# EAGLE design Ffrydiau_controls (EAGLE 9.6.2)
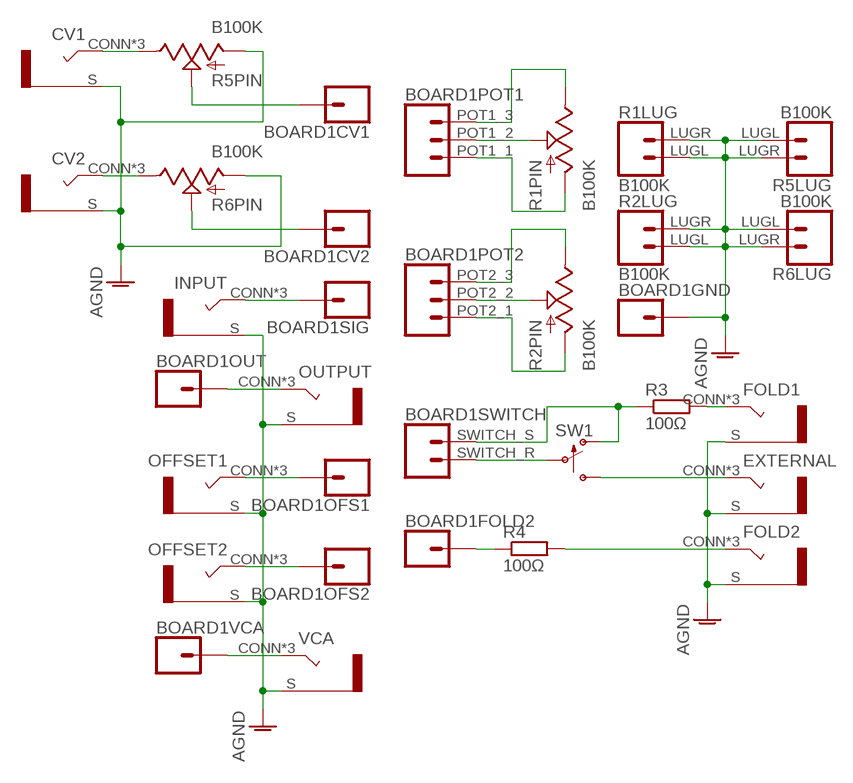
[diagram p0: schematic, sheet 1]

## Parts
BOARD1  FFRYDIAU_LINK  [FFRYDIAU]
CV1  COMBI-JACKCINCHNANA  [NEWCOMBOJACK_PANEL]
CV2  COMBI-JACKCINCHNANA  [NEWCOMBOJACK_PANEL]
EXTERNAL  COMBI-JACKCINCHNANA  [NEWCOMBOJACK_PANEL]
FOLD1  COMBI-JACKCINCHNANA  [NEWCOMBOJACK_PANEL]
FOLD2  COMBI-JACKCINCHNANA  [NEWCOMBOJACK_PANEL]
INPUT  COMBI-JACKCINCHNANA  [NEWCOMBOJACK_PANEL]
OFFSET1  COMBI-JACKCINCHNANA  [NEWCOMBOJACK_PANEL]
OFFSET2  COMBI-JACKCINCHNANA  [NEWCOMBOJACK_PANEL]
OUTPUT  COMBI-JACKCINCHNANA  [NEWCOMBOJACK_PANEL]
R1  B100K  POTENTIOMETER  [ALPHA_RV09_9MMPOT]
R2  B100K  POTENTIOMETER  [ALPHA_RV09_9MMPOT]
R3  100Ω  R-EU_0207/10  [0207/10]
R4  100Ω  R-EU_0207/10  [0207/10]
R5  B100K  POTENTIOMETER  [ALPHA_RV09_9MMPOT]
R6  B100K  POTENTIOMETER  [ALPHA_RV09_9MMPOT]
SW1  SPDT_SWITCHDW1  [MICRODPDT-DW1]
VCA  COMBI-JACKCINCHNANA  [NEWCOMBOJACK_PANEL]

## Nets
AGND: BOARD1.GND CV1.S CV2.S EXTERNAL.S FOLD1.S FOLD2.S INPUT.S OFFSET1.S OFFSET2.S OUTPUT.S R1.LUGL R1.LUGR R2.LUGL R2.LUGR R5.C1(PIN:A) R5.LUGL R5.LUGR R6.C1(PIN:A) R6.LUGL R6.LUGR VCA.S
N$1: CV1.CONN(T) CV1.T1(T) CV1.T2(T) R5.C3(PIN:B)
N$2: BOARD1.CV1 R5.C2(PIN:W)
N$3: BOARD1.SIG INPUT.CONN(T) INPUT.T1(T) INPUT.T2(T)
N$4: BOARD1.OUT OUTPUT.CONN(T) OUTPUT.T1(T) OUTPUT.T2(T)
N$5: BOARD1.POT1_2 R1.C2(PIN:W)
N$6: BOARD1.OFS1 OFFSET1.CONN(T) OFFSET1.T1(T) OFFSET1.T2(T)
N$7: BOARD1.OFS2 OFFSET2.CONN(T) OFFSET2.T1(T) OFFSET2.T2(T)
N$8: BOARD1.VCA VCA.CONN(T) VCA.T1(T) VCA.T2(T)
N$9: BOARD1.POT1_1 R1.C1(PIN:A)
N$10: BOARD1.POT1_3 R1.C3(PIN:B)
N$11: BOARD1.POT2_2 R2.C2(PIN:W)
N$12: BOARD1.POT2_3 R2.C3(PIN:B)
N$13: BOARD1.POT2_1 R2.C1(PIN:A)
N$14: BOARD1.SWITCH_S R3.1 SW1.C1(O)
N$15: FOLD1.CONN(T) FOLD1.T1(T) FOLD1.T2(T) R3.2
N$16: BOARD1.SWITCH_R SW1.C2(P)
N$17: EXTERNAL.CONN(T) EXTERNAL.T1(T) EXTERNAL.T2(T) SW1.C3(S)
N$19: BOARD1.FOLD2 R4.1
N$20: FOLD2.CONN(T) FOLD2.T1(T) FOLD2.T2(T) R4.2
N$21: CV2.CONN(T) CV2.T1(T) CV2.T2(T) R6.C3(PIN:B)
N$22: BOARD1.CV2 R6.C2(PIN:W)

## Library data of the parts
BOARD1 = ElectricNoodleBox:FFRYDIAU_LINK
CV1 CV2 EXTERNAL FOLD1 FOLD2 INPUT OFFSET1 OFFSET2 OUTPUT VCA = ElectricNoodleBox:COMBI-JACK
R1 R2 R5 R6 = ElectricNoodleBox:POTENTIOMETER
R3 R4 = rcl:R-EU_: RESISTOR, European symbol; SPICEPREFIX: R
SW1 = ElectricNoodleBox:SPDT_SWITCH

## Board
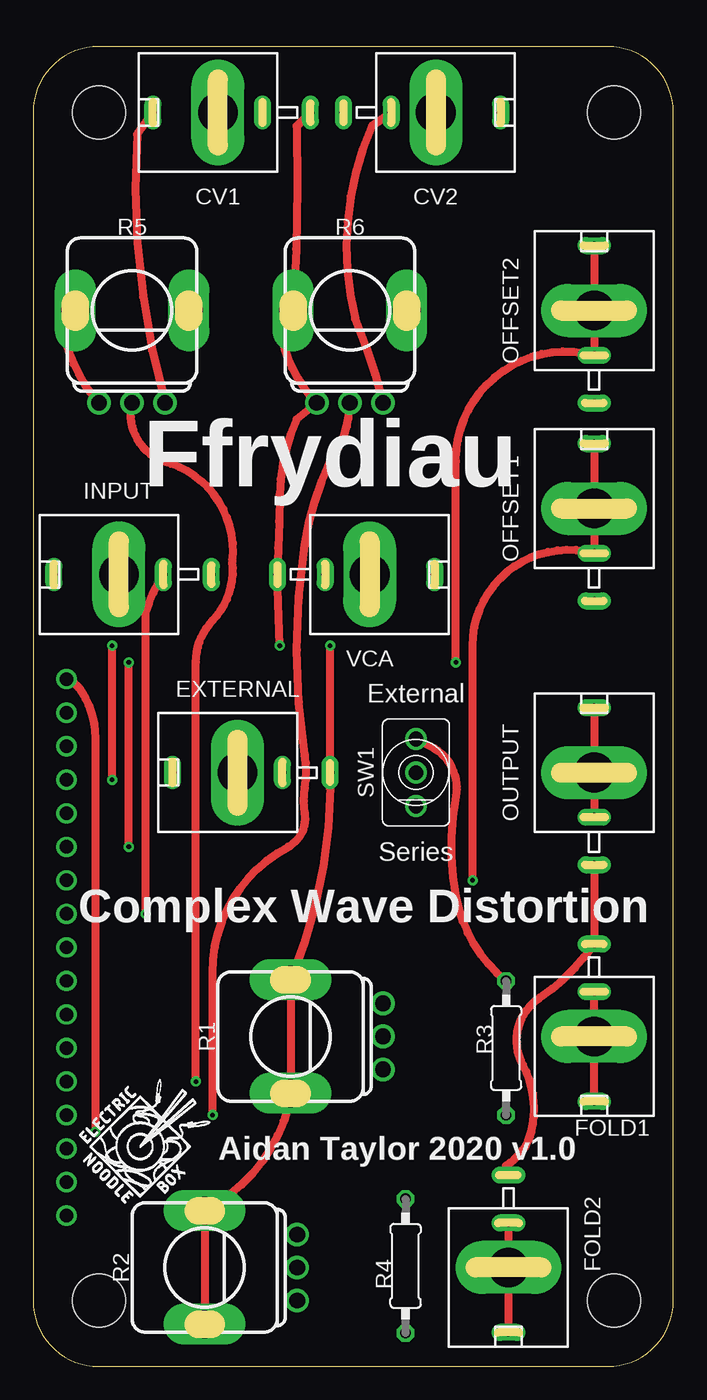
[diagram p1: board, top side]
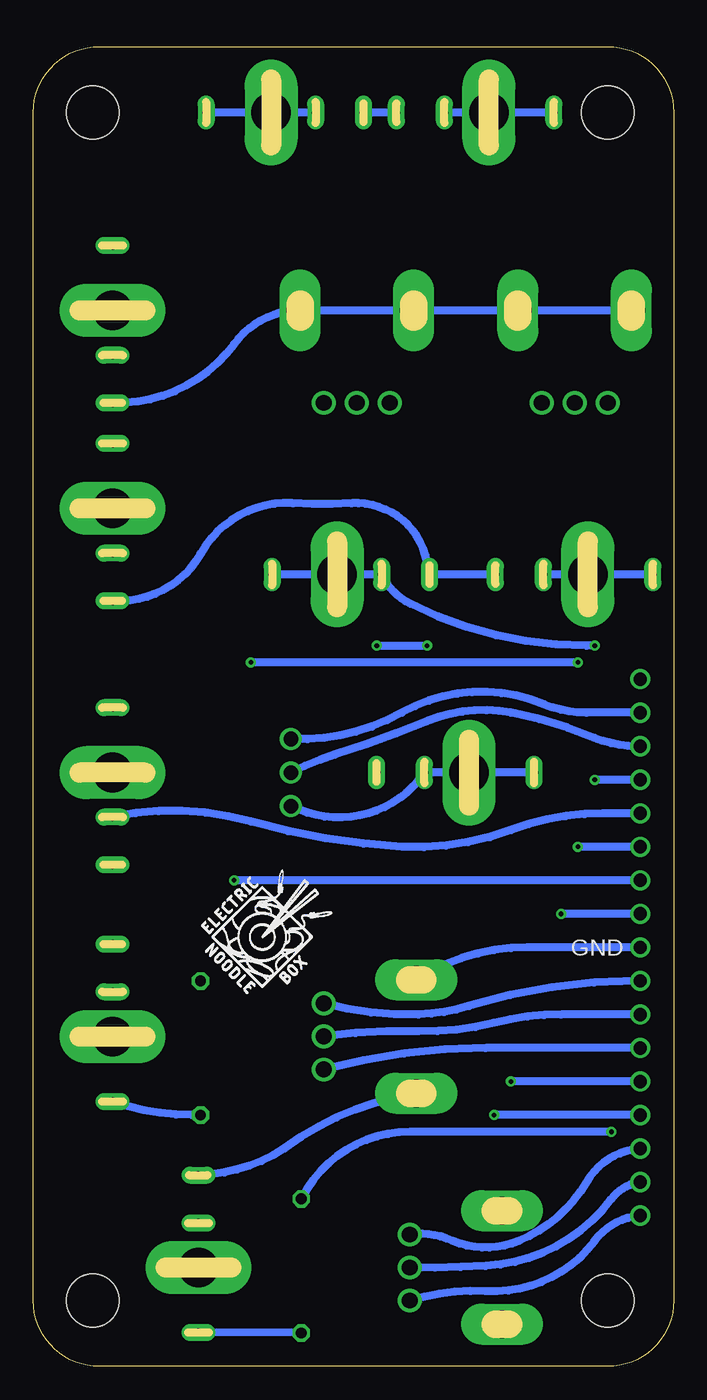
[diagram p2: board, bottom side, seen from below]

Size 48.5 x 100 mm. Coordinates in mm from the lower left corner, seen from the top.
Outline: 0,95 0,5 arc90 5,0 43.5,0 arc90 48.5,5 48.5,95 arc90 43.5,100 5,100 arc90 0,95
Copper layers (1*16): Top 0.035mm / dielectric 1.5mm / Bottom 0.035mm
Design rules "default": minimum track width 6mil, minimum drill 0.35mm, track to track 6mil, track to pad 6mil, pad to pad 6mil, via to via 6mil, smd to smd 6mil, copper to edge 40mil, drill to drill 6mil, minimum pad ring 10mil, minimum via ring 8mil, stop-mask expansion 4mil, vias tented up to drill 0mil, thermal gap 10mil

### Footprints (pad centres in the part's own frame; a part is rotated, then mirrored left to right if it is on the bottom)
FFRYDIAU = drill 1.016: CV1 21.59,2.54; CV2 19.05,2.54; FOLD2 52.07,2.54; GND 31.75,2.54; OFS1 36.83,2.54; OFS2 39.37,2.54; OUT 41.91,2.54; POT1_1 24.13,2.54; POT1_2 26.67,2.54; POT1_3 29.21,2.54; POT2_1 11.43,2.54; POT2_2 13.97,2.54; POT2_3 16.51,2.54; SIG 34.29,2.54; SWITCH_R 46.99,2.54; SWITCH_S 49.53,2.54; VCA 44.45,2.54 | hole 4: 5,5; 95,5; 95,44; 5,44
NEWCOMBOJACK_PANEL = drill 3 pad 3.6 long: CONN 0,0 | drill 0.6 pad 1.27 long: S 0,-7; T1 0,4.92; T2 0,-3.38
ALPHA_RV09_9MMPOT = drill 1.2 pad 1.778: C1 -2.5,-7; C2 0,-7; C3 2.5,-7 | drill 2.1 pad 2.8 long: LUGL -4.3,0; LUGR 4.3,0
0207/10 = drill 0.813 octagon: 1 -5.08,0; 2 5.08,0
MICRODPDT-DW1 = drill 1.1: C1 0,-2.54; C2 0,0; C3 0,2.54

### Placement (x,y rotation side)
BOARD1  0,0 90 bottom
CV1  14,95 90 top
CV2  30.5,95 270 top
EXTERNAL  15.5,45 90 top
FOLD1  42.5,25 180 top
FOLD2  36,7.5 180 top
INPUT  6.5,60 90 top
OFFSET1  42.5,65 0 top
OFFSET2  42.5,80 0 top
OUTPUT  42.5,45 0 top
R1  19.5,25 90 top
R2  13,7.5 90 top
R3  35.83,24.13 270 top
R4  28.21,7.62 270 top
R5  7.5,80 0 top
R6  24,80 0 top
SW1  29,45 180 top
U$1  [LOGO10X10]  3.45,12.06 0 top
U$2  [LOGO10X10]  35.83,27.94 0 bottom
VCA  25.5,60 270 top

### Tracks (layer width: path | path; a pad name or v marks a point on that pad's centre or on a via)
AGND  (via drill 0.35)
  Top 0.61: CV1.S 19.95,93.98 arc-5 R6.LUGL 18.68,78.74 arc36 R6.C1 19.95,71.75 arc22 18.68,66.04 arc-1 VCA.S v18.68,54.61 | R5.LUGL 2.17,79.38 arc37 R5.C1 | v22.5,54.61 EXTERNAL.S 22.5,43.81 arc-23 R1.LUGR R1.LUGL 19.32,19.68 arc-48 R2.LUGR R2.LUGL | OUTPUT.S FOLD1.S arc-22 38.37,27.94 arc85 37.1,22.86 arc-42 37.73,17.78 arc-46 35.83,15.24 FOLD2.S
  Bottom 0.61: R1.LUGR arc32 11.06,31.75 BOARD1.GND | CV1.S CV2.S | R5.LUGL R5.LUGR R6.LUGL R6.LUGR 28.21,80.01 arc-54 33.29,77.47 arc56 OFFSET2.S | OFFSET1.S arc-64 35.83,61.59 arc64 28.84,65.41 arc-7 24.4,65.41 arc82 18.68,60.96 VCA.S INPUT.S | v22.5,54.61 v18.68,54.61 | R1.LUGL 21.23,20.32 arc-25 29.48,16.51 arc31 FOLD2.S
N$1
  Top 0.61: CV1.T1 7.89,93.34 arc19 R5.C3
  Bottom 0.61: CV1.T1 CV1.CONN CV1.T2
N$2  (via drill 0.35)
  Top 0.61: v12.34,21.59 12.34,53.34 arc-44 13.61,56.52 arc50 15.1,61 arc83 9.79,68.58 arc-80 R5.C2
  Bottom 0.61: BOARD1.CV1 v12.34,21.59
N$3  (via drill 0.35)
  Top 0.61: v8.53,34.29 8.53,57.15 arc-14 INPUT.T2
  Bottom 0.61: BOARD1.SIG v8.53,34.29 | INPUT.T1 INPUT.CONN INPUT.T2
N$4
  Top 0.61: OUTPUT.T1 OUTPUT.CONN OUTPUT.T2
  Bottom 0.61: OUTPUT.T2 arc28 32.02,41.27 arc-13 20.59,39.37 arc-24 12.34,40.64 arc21 5.35,41.91 BOARD1.OUT
N$5
  Bottom 0.61: R1.C2 arc10 19.32,25.4 arc-16 13.61,26.04 arc14 8.53,26.67 BOARD1.POT1_2
N$6  (via drill 0.35)
  Top 0.61: v33.29,36.83 33.29,54.61 arc-105 OFFSET1.T2 OFFSET1.CONN OFFSET1.T1
  Bottom 0.61: BOARD1.OFS1 v33.29,36.83
N$7  (via drill 0.35)
  Top 0.61: v7.26,39.37 v7.26,53.34 | v32.02,53.34 32.02,68.58 arc-105 OFFSET2.T2 OFFSET2.CONN OFFSET2.T1
  Bottom 0.61: BOARD1.OFS2 v7.26,39.37 | v7.26,53.34 v32.02,53.34
N$8  (via drill 0.35)
  Top 0.61: v5.99,44.45 v5.99,54.61
  Bottom 0.61: BOARD1.VCA v5.99,44.45 | v5.99,54.61 6.62,54.61 arc27 19.95,57.78 arc38 VCA.T2 VCA.CONN VCA.T1
N$9
  Bottom 0.61: BOARD1.POT1_1 14.24,24.13 arc-15 R1.C1
N$10
  Bottom 0.61: BOARD1.POT1_3 2.81,29.21 arc-17 15.51,27.3 arc15 19.32,26.67 arc17 R1.C3
N$11
  Bottom 0.61: BOARD1.POT2_2 2.17,13.97 arc-53 4.71,12.7 arc50 14.24,7.62 arc4 R2.C2
N$12
  Bottom 0.61: BOARD1.POT2_3 2.17,16.51 arc-59 6.62,13.97 arc37 11.7,9.53 arc46 16.78,9.53 arc-33 R2.C3
N$13
  Bottom 0.61: BOARD1.POT2_1 2.17,11.43 arc-53 5.99,9.53 arc57 14.24,5.71 arc-19 R2.C1
N$14
  Top 0.61: SW1.C1 30.11,46.99 arc-74 32.02,43.18 arc21 32.02,35.56 arc41 R3.1
  Bottom 0.61: SW1.C1 arc-32 20.59,49.53 arc52 9.79,50.16 arc-23 6.62,49.53 BOARD1.SWITCH_S
N$15
  Top 0.61: FOLD1.T1 FOLD1.CONN FOLD1.T2
  Bottom 0.61: R3.2 36.47,19.05 arc19 FOLD1.T1
N$16
  Bottom 0.61: BOARD1.SWITCH_R 2.81,46.99 arc23 5.99,47.62 arc-12 12.34,49.53 arc-33 18.68,48.9 arc4 25.67,46.35 arc-9 SW1.C2
N$17
  Bottom 0.61: EXTERNAL.T1 EXTERNAL.CONN EXTERNAL.T2 19.32,44.45 arc35 23.13,41.91 arc43 SW1.C3
N$19  (via drill 0.35)
  Top 0.61: BOARD1.FOLD2 2.17,52.07 arc-53 3.45,51.44 arc-37 4.71,47.62 v4.71,17.78
  Bottom 0.61: R4.1 arc63 19.95,17.78 v4.71,17.78
N$20
  Top 0.61: FOLD2.T2 FOLD2.CONN FOLD2.T1
  Bottom 0.61: R4.2 FOLD2.T1
N$21
  Top 0.61: CV2.T2 25.67,93.98 arc38 24.4,79.38 arc-8 R6.C3
  Bottom 0.61: CV2.T2 CV2.CONN CV2.T1
N$22  (via drill 0.35)
  Top 0.61: v13.61,19.05 13.61,29.84 arc-62 19.32,39.37 arc71 20.59,41.91 arc-18 20.59,43.81 arc18 20.59,46.35 arc-18 20.59,62.23 arc-16 22.5,68.58 arc36 R6.C2
  Bottom 0.61: BOARD1.CV2 v13.61,19.05

### Text on the board
tPlace: Ffrydiau | External | Series | Complex Wave Distortion | Aidan Taylor 2020 v1.0